# Altium schematic sheet LB-char-coilRectifier.SchDoc
size A4
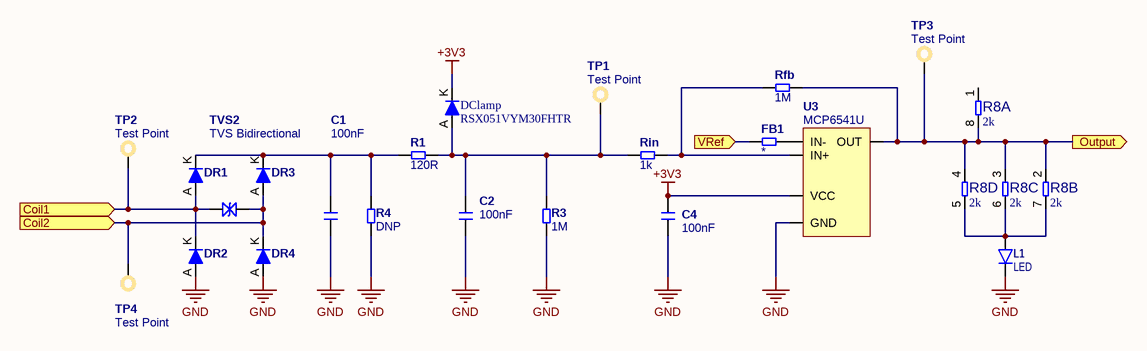
[diagram p0: LB-char-coilRectifier.SchDoc]

## Parts
C1  100nF  [C0603_N]
C2  100nF  [C0603_N]
C4  100nF  [C0603_N]
DClamp  RSX051VYM30FHTR  [SOD323F]
DR1  RSX051VYM30FHTR  [SOD323F]  (value not drawn)
DR2  RSX051VYM30FHTR  [SOD323F]  (value not drawn)
DR3  RSX051VYM30FHTR  [SOD323F]  (value not drawn)
DR4  RSX051VYM30FHTR  [SOD323F]  (value not drawn)
FB1  FB  [R0603]  (value not drawn)
L1  LED  [LED 0603/1608]
R1  120R  [R0603]
R3  1M  [R0603]
R4  DNP  [R0603]
R8  value 2k  [YC164]  (parts A,B,C,D of 4)
Rfb  1M  [R0603]
Rin  1k  [R0603]
TP1  Test Point  [Harwin S2751-46R]
TP2  Test Point  [Harwin S2751-46R]
TP3  Test Point  [Harwin S2751-46R]
TP4  Test Point  [Harwin S2751-46R]
TVS2  TVS Bidirectional  [SOD323F-Comchip Variant]
U3  MCP6541U  [SOT23-5_N]

## Ports
Coil1 (in), Coil2 (in), Output (out), VRef (in)

## Nets
+3V3: C4.1 DClamp.K U3.5(VCC)
GND: C1.2 C2.2 C4.2 DR2.A DR4.A L1.1(K) R3.1 R4.1 U3.2(GND)
Coil1: DR1.A DR2.K TP2.1 TVS2.2 ; port Coil1
Coil2: DR3.A DR4.K TP4.1 TVS2.1 ; port Coil2
Output: R8.2 R8.3 R8.4 R8.8 Rfb.2 TP3.1 U3.4(OUT) ; port Output
VRef: FB1.1 ; port VRef
NetC1_1: C1.1 DR1.K DR3.K R1.1 R4.2
NetC2_1: C2.1 DClamp.A R1.2 R3.2 Rin.1 TP1.1
NetFB1_2: FB1.2 U3.3(IN-)
NetL1_2: L1.2(A) R8.5 R8.6 R8.7
NetRfb_1: Rfb.1 Rin.2 U3.1(IN+)

Not connected (* = marked no-connect by the designer): R8 1

## Library data of the parts
C1 C2 C4 = Capacitor: Capacitor MLCC; Manufacturer: Yageo; Manufacturer Part Number: CC0603KRX7R9BB104; Tolerance (%): 10; Category: Capacitor; Package: 0603; Value: 100nF; Supplier Part Number 1: 1362556; Supplier 1: Farnell; ComponentLink1URL: http://www.yageo.com; ComponentLink1Description: Manufacturer Website; Voltage Rating (Volts): *; Supplier 2: Digi-Key; Supplier Part Number 2: 311-1344-1-ND
DClamp DR1-DR4 = Diode
FB1 R1 R3 R4 Rfb Rin = Resistor: Published: 17-Dec-2003; LatestRevisionDate: 19-Mar-2004; LatestRevisionNote: Silkscreen size reduced.; PackageDocument: Mar-2003; PackageReference: 3-0603; Publisher: Altium Limited; Code_IPC: 1608 [0603]; ComponentLink1Description: Manufacturer Link; ComponentLink1URL: http://www.panasonic.com/industrial/components/resistive_products.htm; ComponentLink2Description: Datasheet; ComponentLink2URL: http://www.panasonic.com/industrial/components/pdf/AOA0000CE2.pdf
  FB1: Value: *
  R1: Value: 120R
  R3 Rfb: Value: 1M
  R4: Value: DNP
  Rin: Value: 1k
R8 = Resistor Array - 4P